# Altium schematic sheet P11.SchDoc: P11
size OrCAD A; DocumentNumber: P11; Revision: A; SheetNumber: 1; SheetTotal: 1; ProjectName: P11
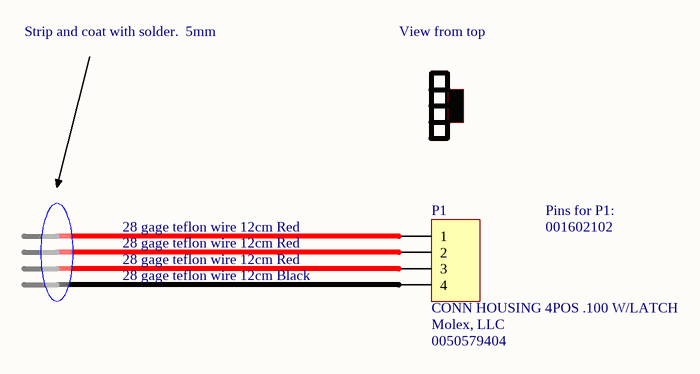
[diagram p0: P11.SchDoc]

## Parts
P1  CONN HOUSING 4POS .100 W/LATCH  Manufacturer: Molex, LLC  Manufacturer Part Number: 0050579404  [HDR1X4]

## Nets

Not connected (* = marked no-connect by the designer): P1 1 2 3 4

## Notes on the sheet
- Strip and coat with solder.  5mm
- View from top
- 28 gage teflon wire 12cm Red
- Pins for P1:
- 001602102
- 28 gage teflon wire 12cm Black
- Title
- Size:
- Date:
- Orcad A
- Number:
- Time:
- Revision:
- Sheet
- of
- ZLS Corporation
- 7801 North Lamar Blvd.
- Suite E-184
- Austin, Texas 78752  USA
- (512) 453-0288
- File:

## Library data of the parts
P1 = Header 4: Connector Type: Receptacle; Number of Positions: 4; Pitch: 0.100" (2.54mm); Contact Termination: Crimp; Note: Contacts Not Included; Supplier 1: Digi-Key; Supplier Part Number 1: WM2902-ND; RoHS: RoHS Compliant; Description: CONN HOUSING 4POS .100 W/LATCH; Category: Connectors, Interconnects; Stock 1: 100953; Pricing 1: 1=0.27, 10=0.255, 25=0.2172, 50=0.1902, 100=0.1765, 250=0.15616, 500=0.14938, 1000=0.12222, 2500=0.11204 (USD); Packaging: Bulk; Part Status: Active; Contact Type: Female Socket; Number of Rows: 1; Row Spacing: -; Mounting Type: Free Hanging (In-Line); Fastening Type: Latch Lock; Color: Black; Features: -; ComponentLink1URL: http://www.molex.com/pdm_docs/sd/050579404_sd.pdf; ComponentLink1Description: http://www.molex.com/pdm_docs/sd/050579404_sd.pdf